# Altium schematic sheet LNA.SchDoc
size A4
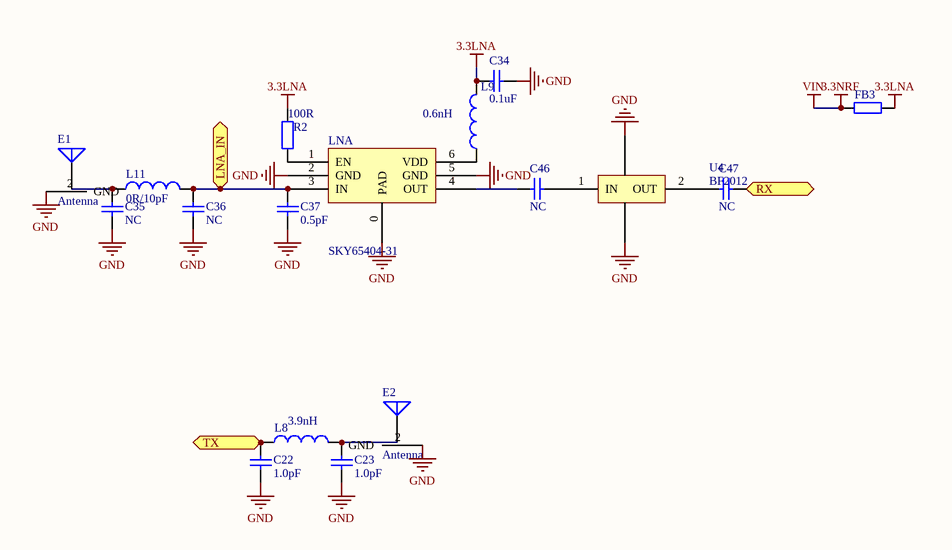
[diagram p0: LNA.SchDoc]

## Parts
C22  value 1.0pF  [0402]  (hidden comment: Cap)
C23  value 1.0pF  [0402]  (hidden comment: Cap)
C34  value 0.1uF  [0402]  (hidden comment: Cap)
C35  value NC  [0402]  (hidden comment: Cap)
C36  value NC  [0402]  (hidden comment: Cap)
C37  value 0.5pF  [0402]  (hidden comment: Cap)
C46  value NC  [0402]  (hidden comment: Cap)
C47  value NC  [0402]  (hidden comment: Cap)
E1  Antenna  [IPEX]
E2  Antenna  [IPEX]
FB3  Res2  [0402]  (value not drawn)
L8  value 3.9nH  [0402]  (hidden comment: Inductor)
L9  value 0.6nH  [0402]  (hidden comment: Inductor)
L11  value 0R/10pF  [0402]  (hidden comment: Inductor)
LNA  SKY65404-31  [SKY65404-31]
R2  value 100R  [0402]  (hidden comment: Res2)
U4  BF2012  [LFB2H5]

## Ports
LNA_IN, RX, TX

## Nets
3.3LNA: C34.2 FB3.2 L9.2 R2.2
3.3NRF: FB3.1  [also labelled VIN]
GND: C22.2 C23.2 C34.1 C35.1 C36.1 C37.1 E1.2(GND) E2.2(GND) LNA.0(PAD) LNA.2(GND) LNA.5(GND) U4.0(GND)
LNA_IN: C36.2 C37.2 L11.2 LNA.3(IN) ; port LNA_IN
RX: C47.2 ; port RX
TX: C22.1 L8.1 ; port TX
NetC23_1: C23.1 E2.1(ANT) L8.2
NetC35_2: C35.2 E1.1(ANT) L11.1
NetC46_1: C46.1 LNA.4(OUT)
NetC46_2: C46.2 U4.1(IN)
NetC47_1: C47.1 U4.2(OUT)
NetL9_1: L9.1 LNA.6(VDD)
NetLNA_1: LNA.1(EN) R2.1

## Library data of the parts
C22 C23 C34-C37 C46 C47 = Cap: Capacitor; Published: 8-Jun-2000; LatestRevisionDate: 17-Jul-2002; LatestRevisionNote: Re-released for DXP Platform.; PackageReference: RAD-0.3; Publisher: Altium Limited; PackageDescription: Radial Cap, Thru-Hole; 2 Leads; 0.3 in Pin Spacing
E1 E2 = Antenna: Generic Antenna; Published: 24-Mar-1999; LatestRevisionDate: 17-Jul-2002; LatestRevisionNote: Re-released for DXP Platform.; PackageReference: PIN1; Publisher: Altium Limited
FB3 = Res2: Resistor; Value: FB; Published: 8-Jun-2000; LatestRevisionDate: 17-Jul-2002; LatestRevisionNote: Re-released for DXP Platform.; PackageReference: AXIAL-0.4; Publisher: Altium Limited; PackageDescription: Axial Device, Thru-Hole; 2 Leads; 0.4 in Pin Spacing
L8 L9 L11 = Inductor: Code_IEC: 1005; Published: 8-Jun-2000; LatestRevisionDate: 29-May-2009; LatestRevisionNote: IPC-7351 Footprint Added.; PackageReference: 0402-A; Publisher: Altium Limited; PackageDescription: Chip Inductor; Code_JEITA: 0402
R2 = Res2: Resistor; Published: 8-Jun-2000; LatestRevisionDate: 17-Jul-2002; LatestRevisionNote: Re-released for DXP Platform.; PackageReference: AXIAL-0.4; Publisher: Altium Limited; PackageDescription: Axial Device, Thru-Hole; 2 Leads; 0.4 in Pin Spacing